# Altium schematic sheet cc_gen_and_heat_pwr.SchDoc: Hall / Main Board / current gen.
size A4; DocumentNumber: 3; SheetNumber: 3; SheetTotal: 7
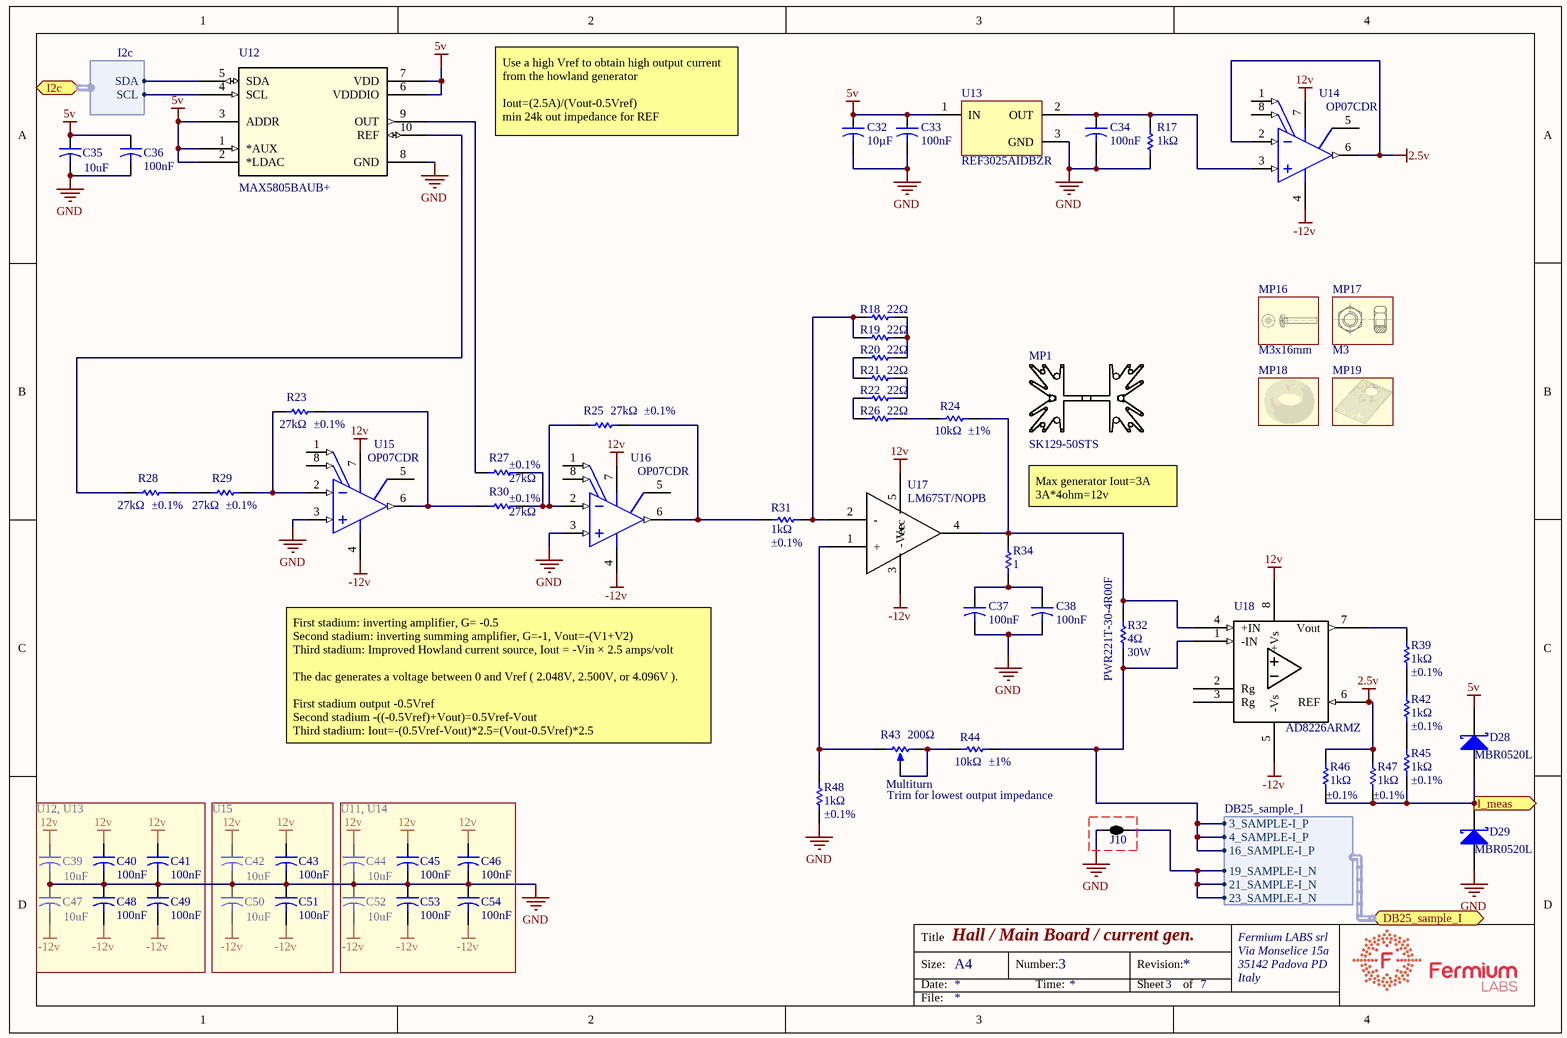
[diagram p0: cc_gen_and_heat_pwr.SchDoc]

## Parts
C32  Capacitance: 10µF  [CAP 1206/3216]
C33  Capacitance: 100nF  [CAP 0805/2012]
C34  Capacitance: 100nF  [CAP 0805/2012]
C35  value 10uF  [CAP 1206/3216]  (hidden comment: Cap2)
C36  Capacitance: 100nF  [CAP 0805/2012]
C37  Capacitance: 100nF  [CAP 0805/2012]
C38  Capacitance: 100nF  [CAP 0805/2012]
C39  value 10uF  [CAP 1206/3216]  (hidden comment: Cap2)
C40  Capacitance: 100nF  [CAP 0805/2012]
C41  Capacitance: 100nF  [CAP 0805/2012]
C42  value 10uF  [CAP 1206/3216]  (hidden comment: Cap2)
C43  Capacitance: 100nF  [CAP 0805/2012]
C44  value 10uF  [CAP 1206/3216]  (hidden comment: Cap2)
C45  Capacitance: 100nF  [CAP 0805/2012]
C46  Capacitance: 100nF  [CAP 0805/2012]
C47  value 10uF  [CAP 1206/3216]  (hidden comment: Cap2)
C48  Capacitance: 100nF  [CAP 0805/2012]
C49  Capacitance: 100nF  [CAP 0805/2012]
C50  value 10uF  [CAP 1206/3216]  (hidden comment: Cap2)
C51  Capacitance: 100nF  [CAP 0805/2012]
C52  value 10uF  [CAP 1206/3216]  (hidden comment: Cap2)
C53  Capacitance: 100nF  [CAP 0805/2012]
C54  Capacitance: 100nF  [CAP 0805/2012]
D28  Supplier Part Number 1: MBR0520L  [SOD123]
D29  Supplier Part Number 1: MBR0520L  [SOD123]
J10  2 way net tie junction  [2way_LP]  (value not drawn)  (net tie, no BOM)
MP1  (no value)  [SK129-50STS]
MP16  Size: M3x16mm  (hidden comment: screw-M3x25mm)  (mechanical)
MP17  Size: M3  (hidden comment: nut-M3)  (mechanical)
MP18  isolator-TO220  (value not drawn)  (mechanical)
MP19  thermpad-TO220  (value not drawn)  (mechanical)
R17  Resistance: 1kΩ  [RES 0805/2012]
R18  Resistance: 22Ω  [RES 0805/2012]
R19  Resistance: 22Ω  [RES 0805/2012]
R20  Resistance: 22Ω  [RES 0805/2012]
R21  Resistance: 22Ω  [RES 0805/2012]
R22  Resistance: 22Ω  [RES 0805/2012]
R23  Resistance: 27kΩ  Tolerance: ±0.1%  [RES 0805/2012]
R24  Resistance: 10kΩ  Tolerance: ±1%  [RES 0805/2012]
R25  Resistance: 27kΩ  Tolerance: ±0.1%  [RES 0805/2012]
R26  Resistance: 22Ω  [RES 0805/2012]
R27  Resistance: 27kΩ  Tolerance: ±0.1%  [RES 0805/2012]
R28  Resistance: 27kΩ  Tolerance: ±0.1%  [RES 0805/2012]
R29  Resistance: 27kΩ  Tolerance: ±0.1%  [RES 0805/2012]
R30  Resistance: 27kΩ  Tolerance: ±0.1%  [RES 0805/2012]
R31  Resistance: 1kΩ  Tolerance: ±0.1%  [RES 0805/2012]
R32  Resistance: 4Ω  Power: 30W  Manufacturer Part Number: PWR221T-30-4R00F  [to220-2pin]
R34  Resistance: 1  [STACKPOLE CSRN2512]
R39  Resistance: 1kΩ  Tolerance: ±0.1%  [RES 0805/2012]
R42  Resistance: 1kΩ  Tolerance: ±0.1%  [RES 0805/2012]
R43  Multiturn  Resistance: 200Ω  [trimmer-multiturn]
R44  Resistance: 10kΩ  Tolerance: ±1%  [RES 0805/2012]
R45  Resistance: 1kΩ  Tolerance: ±0.1%  [RES 0805/2012]
R46  Resistance: 1kΩ  Tolerance: ±0.1%  [RES 0805/2012]
R47  Resistance: 1kΩ  Tolerance: ±0.1%  [RES 0805/2012]
R48  Resistance: 1kΩ  Tolerance: ±0.1%  [RES 0805/2012]
U12  Manufacturer Part Number: MAX5805BAUB+  [21-0061L]
U13  (no value)  [TI-DBZ3_N]
U14  (no value)  [TI-D8_N]
U15  (no value)  [TI-D8_N]
U16  (no value)  [TI-D8_N]
U17  Supplier Part Number 1: LM675T/NOPB  [TO-220-5]
U18  Manufacturer Part Number: AD8226ARMZ  [MSOP_MO-187-AA AD8220]

## Blocks framed on the sheet
U12, U13: C39-C41 C47-C49
U15: C42 C43 C50 C51
U11, U14: C44-C46 C52-C54

## Ports
DB25_sample_I (harness DB25_sample_I), I2c (harness I2c), I_meas (out)

## Harnesses
I2c: SDA, SCL
DB25_sample_I: 16_SAMPLE-I_P, 19_SAMPLE-I_N, 21_SAMPLE-I_N, 23_SAMPLE-I_N, 3_SAMPLE-I_P, 4_SAMPLE-I_P

## Nets
2.5v: R46.2 R47.2 U14.2(IN-) U14.6(OUT) U18.6(REF)
5v: C32.1 C33.1 C35.1 C36.1 D28.K U12.1(*AUX) U12.2(*LDAC) U12.3(ADDR) U12.6(VDDDIO) U12.7(VDD) U13.1(IN)
12v: C39.1 C40.1 C41.1 C42.1 C43.1 C44.1 C45.1 C46.1 U14.7(VCC+) U15.7(VCC+) U16.7(VCC+) U17.5(Vcc) U18.8(+Vs)
-12v: C47.2 C48.2 C49.2 C50.2 C51.2 C52.2 C53.2 C54.2 U14.4(VCC-) U15.4(VCC-) U16.4(VCC-) U17.3(-Vee) U18.5(-Vs)
GND: C32.2 C33.2 C34.2 C35.2 C36.2 C37.2 C38.2 C39.2 C40.2 C41.2 C42.2 C43.2 C44.2 C45.2 C46.2 C47.1 C48.1 C49.1 C50.1 C51.1 C52.1 C53.1 C54.1 D29.A J10.1 R17.2 R48.2 U12.8(GND) U13.3(GND) U15.3(IN+) U16.3(IN+)
I_meas: D28.A D29.K R45.1 R46.1 R47.1 ; port I_meas
NetC34_1: C34.1 R17.1 U13.2(OUT) U14.3(IN+)
NetC37_1: C37.1 C38.1 R34.1
NetJ10_2: J10.2 ; port DB25_sample_I.19_SAMPLE-I_N, port DB25_sample_I.21_SAMPLE-I_N, port DB25_sample_I.23_SAMPLE-I_N
NetR18_1: R18.1 R19.1 R20.1
NetR18_2: R18.2 R19.2 R31.2 U17.2(-)
NetR20_2: R20.2 R21.2
NetR21_1: R21.1 R22.1
NetR22_2: R22.2 R26.2
NetR23_1: R23.1 R30.2 U15.6(OUT)
NetR23_2: R23.2 R29.1 U15.2(IN-)
NetR24_1: R24.1 R32.1 R34.2 U17.4(OUT) U18.4(+IN)
NetR24_2: R24.2 R26.1
NetR25_1: R25.1 R31.1 U16.6(OUT)
NetR25_2: R25.2 R27.1 R30.1 U16.2(IN-)
NetR27_2: R27.2 U12.9(OUT)
NetR28_1: R28.1 R29.2
NetR28_2: R28.2 U12.10(REF)
NetR32_2: R32.2 R44.1 U18.1(-IN) ; port DB25_sample_I.16_SAMPLE-I_P, port DB25_sample_I.3_SAMPLE-I_P, port DB25_sample_I.4_SAMPLE-I_P
NetR39_1: R39.1 R42.2
NetR39_2: R39.2 U18.7(Vout)
NetR42_1: R42.1 R45.2
NetR43_1: R43.1 R48.1 U17.1(+)
NetR43_2: R43.2 R43.3 R44.2
NetU12_4: U12.4(SCL) ; port I2c.SCL
NetU12_5: U12.5(SDA) ; port I2c.SDA

Not connected (* = marked no-connect by the designer): U14 1(OFFSET_N1) 5(NC) 8(OFFSET_N2); U15 1(OFFSET_N1) 5(NC) 8(OFFSET_N2); U16 1(OFFSET_N1) 5(NC) 8(OFFSET_N2); U18 2(Rg) 3(Rg)

## Notes on the sheet
- Use a high Vref to obtain high output current from the howland generator
  Iout=(2.5A)/(Vout-0.5Vref)
  min 24k out impedance for REF
- Max generator Iout=3A
  3A*4ohm=12v
- First stadium: inverting amplifier, G= -0.5
  Second stadium: inverting summing amplifier, G=-1, Vout=-(V1+V2)
  Third stadium: Improved Howland current source, Iout = -Vin × 2.5 amps/volt
  The dac generates a voltage between 0 and Vref ( 2.048V, 2.500V, or 4.096V ).
  First stadium output -0.5Vref
  Second stadium -((-0.5Vref)+Vout)=0.5Vref-Vout
  Third stadium: Iout=-(0.5Vref-Vout)*2.5=(Vout-0.5Vref)*2.5
- Trim for lowest output impedance
- Title
- Size:
- Date:
- A4
- Number:
- Time:
- Revision:
- Sheet
- of
- Fermium LABS srl
- Via Monselice 15a
- 35142 Padova PD
- Italy
- File:

## Library data of the parts
C32 = Cap2: Capacitor; Manufacturer: SAMSUNG; Manufacturer Part Number: CL31A106KAHNNNE; Unit: pcs; SuppliedAmount: 0; MinAmount: 100; Capacitor type: ceramic; Capacitor kind: MLCC; Operating voltage: 25V; Dielectric: X5R; Tolerance: ±10%; Case - inch: 1206; Case - mm: 3216; Pads: 2 SMD; Published: 23-Sep-2002; PackageReference: CAPR5-4X5; Publisher: Altium Limited; PackageDescription: 1206; Supplier 1: TME; Supplier Part Number 1: CL31A106KAHNNNE; Category: 1206 MLCC SMD Capacitors; Stock 1: 279700; Pricing 1: 100=0.0248, 300=0.0203, 1000=0.0167, 2000=0.0131, 10000=0.0127 (EUR); Weight: 0.061; Multiples: 100; Mounting: SMD; Operating temperature: -55...85°C; Price Type: NET; ComponentLink1URL: http://static.tme.eu/products_pics/b/e/9/be9e0dd298dcf4979ea1dd3d226e0bfa/58780.jpg; ComponentLink1Description: http://static.tme.eu/products_pics/b/e/9/be9e0dd298dcf4979ea1dd3d226e0bfa/58780.jpg
C33 C34 C37 C38 = Cap2: Capacitor; Manufacturer: YAGEO; Manufacturer Part Number: CC0805JRX7R9BB104; Unit: pcs; SuppliedAmount: 0; MinAmount: 100; Capacitor type: ceramic; Capacitor kind: MLCC; Operating voltage: 50V; Dielectric: X7R; Tolerance: ±5%; Case - inch: 0805; Case - mm: 2012; Pads: 2 SMD; Supplier 1: TME; Supplier Part Number 1: CC0805JRX7R9104; Category: 0805 MLCC SMD Capacitors; Stock 1: 89911; Pricing 1: 100=0.00613, 300=0.00464, 1000=0.00342, 4000=0.00284, 20000=0.00273 (EUR); Weight: 0.042; Multiples: 100; Mounting: SMD; Price Type: NET; ComponentLink1URL: http://static.tme.eu/products_pics/d/b/b/dbbd93eaf25225110ca26eb66da77328/58538.jpg; ComponentLink1Description: http://static.tme.eu/products_pics/d/b/b/dbbd93eaf25225110ca26eb66da77328/58538.jpg
C35 C39 C42 C47 C50 C52 = Cap2: Capacitor; Manufacturer: SAMSUNG; Manufacturer Part Number: CL31A106KAHNNNE; Unit: pcs; SuppliedAmount: 0; MinAmount: 100; Capacitor type: ceramic; Capacitor kind: MLCC; Capacitance: 10µF; Operating voltage: 25V; Dielectric: X5R; Tolerance: ±10%; Case - inch: 1206; Case - mm: 3216; Pads: 2 SMD; Published: 23-Sep-2002; PackageReference: CAPR5-4X5; Publisher: Altium Limited; PackageDescription: 1206; Supplier 1: TME; Supplier Part Number 1: CL31A106KAHNNNE; Category: 1206 MLCC SMD Capacitors; Stock 1: 279700; Pricing 1: 100=0.0248, 300=0.0203, 1000=0.0167, 2000=0.0131, 10000=0.0127 (EUR); Weight: 0.061; Multiples: 100; Mounting: SMD; Operating temperature: -55...85°C; Price Type: NET; ComponentLink1URL: http://static.tme.eu/products_pics/b/e/9/be9e0dd298dcf4979ea1dd3d226e0bfa/58780.jpg; ComponentLink1Description: http://static.tme.eu/products_pics/b/e/9/be9e0dd298dcf4979ea1dd3d226e0bfa/58780.jpg
C36 C40 C41 C43 C45 C46 C48 C49 C51 C53 C54 = Cap2: Capacitor; Manufacturer: YAGEO; Manufacturer Part Number: CC0805JRX7R9BB104; Pads: 2 SMD; Supplier 1: TME; Supplier Part Number 1: CC0805JRX7R9104
C44 = Cap2: Capacitor; Manufacturer: SAMSUNG; Manufacturer Part Number: CL31A106KAHNNNE; Unit: pcs; SuppliedAmount: 0; MinAmount: 100; Capacitor type: ceramic; Capacitor kind: MLCC; Capacitance: 10µF; Operating voltage: 25V; Dielectric: X5R; Tolerance: ±10%; Case - inch: 1206; Case - mm: 3216; 2 SMD: Pads; Pads: 2 SMD; Published: 23-Sep-2002; PackageReference: CAPR5-4X5; Publisher: Altium Limited; PackageDescription: 1206; Supplier 1: TME; Supplier Part Number 1: CL31A106KAHNNNE; Category: 1206 MLCC SMD Capacitors; Stock 1: 279700; Pricing 1: 100=0.0248, 300=0.0203, 1000=0.0167, 2000=0.0131, 10000=0.0127 (EUR); Weight: 0.061; Multiples: 100; Mounting: SMD; Operating temperature: -55...85°C; Price Type: NET; ComponentLink1URL: http://static.tme.eu/products_pics/b/e/9/be9e0dd298dcf4979ea1dd3d226e0bfa/58780.jpg; ComponentLink1Description: http://static.tme.eu/products_pics/b/e/9/be9e0dd298dcf4979ea1dd3d226e0bfa/58780.jpg
D28 D29 = D Schottky: Schottky Diode; Manufacturer: FAIRCHILD SEMICONDUCTOR; Unit: pcs; SuppliedAmount: 0; MinAmount: 10; Multiples: 1; Diode type: Schottky rectifying; Off state voltage max.: 20V; Forward voltage at If: 390mV; Load current: 500mA; Pads: 2 SMD; Published: 8-Jun-2000; LatestRevisionDate: 17-Jul-2002; LatestRevisionNote: Re-released for DXP Platform.; PackageReference: SMB; Publisher: Altium Limited; PackageDescription: DO-214-AA/SMB; 2 C-Bend Leads; Body 5.3 x 3.6 mm, inc. leads (LxW); Code_JEDEC: DO-214-AA; Supplier 1: TME; Manufacturer Part Number: MBR0520L; Category: SMD Schottky Diodes; Stock 1: 24595; Pricing 1: 10=0.0403, 50=0.0376, 250=0.0333, 1000=0.03, 3000=0.0281 (EUR); Weight: 0.032; Case: SOD123; Mounting: SMD; Price Type: NET; ComponentLink1URL: http://static.tme.eu/products_pics/e/d/b/edbd030cb344fc64745afa0f91101952/285567.jpg; ComponentLink1Description: http://static.tme.eu/products_pics/e/d/b/edbd030cb344fc64745afa0f91101952/285567.jpg
J10 = 2way: ComponentLink1URL: http://www.edatools.cz/addons; ComponentLink1Description: Source; FootprintNote: LP=12mil, MP=40mil, HP=120mil
MP1 = SK129-63STS: Pads: 2 THT; Supplier 1: TME; Supplier Part Number 1: SK129-50STS; Manufacturer Part Number: SK129-50STS
MP16 = screw-M3x25mm: Manufacturer Part Number: M3X16/D7985; Manufacturer: KRAFTBERG; Supplier 1: TME; Supplier Part Number 1: M3X16/D7985
MP17 = nut-M3: Manufacturer Part Number: 1874659; Manufacturer: BOSSARD; Supplier 1: TME; Supplier Part Number 1: B3/BN117
MP18 = isolator-TO220: Manufacturer Part Number: NIPPEL-TO220/1; Manufacturer: NINIGI; Supplier 1: TME; Supplier Part Number 1: NIPPEL-TO220/1
MP19 = thermpad-TO220: Manufacturer Part Number: GS 220 4; Manufacturer: FISCHER ELEKTRONIK; Supplier 1: TME; Supplier Part Number 1: GS/220/4
R17 = Res1: Resistor; Manufacturer: VIKING; Manufacturer Part Number: AR05BTCW1001; Manufacturer series: AR; Unit: pcs; SuppliedAmount: 0; MinAmount: 10; Kind of resistor: precise; Case - inch: 0805; Case - mm: 2012; Power: 0.125W; Tolerance: ±0.1%; Max. operating voltage: 150V; Max. overload voltage: 300V; Temperature coefficient: 25ppm/°C; Pads: 2 SMD; Published: 8-Jun-2000; LatestRevisionDate: 17-Jul-2002; LatestRevisionNote: Re-released for DXP Platform.; PackageReference: AXIAL-0.3; Publisher: Altium Limited; PackageDescription: Axial Device, Thru-Hole; 2 Leads; 0.3 in Pin Spacing; Supplier 1: TME; Supplier Part Number 1: AR0805-1K-0.1%; Category: 0805 SMD Precision Resistors; Stock 1: 0; Pricing 1: 10=0.11211, 100=0.05707, 1000=0.03771, 5000=0.03176 (EUR); Weight: 0.034; Multiples: 10; Resistor type: thin film; Mounting: SMD; Operating temperature: -55...155°C; Price Type: NET; ComponentLink1URL: http://static.tme.eu/products_pics/6/6/c/66cc5cd64257edd80ca8e9fd2040972d/56038.jpg; ComponentLink1Description: http://static.tme.eu/products_pics/6/6/c/66cc5cd64257edd80ca8e9fd2040972d/56038.jpg; Supplier 2: TME; Supplier Part Number 2: AR0805-1K13-0.1%; Stock 2: 750; Pricing 2: 10=0.11119, 100=0.05661, 1000=0.0374, 5000=0.0315 (EUR)
R18-R22 R26 = Res1: Resistor; Manufacturer: ROYAL OHM; Manufacturer Part Number: 0805S8F220JT5E; Unit: pcs; SuppliedAmount: 0; MinAmount: 100; Case - inch: 0805; Case - mm: 2012; Power: 0.125W; Tolerance: ±1%; Max. operating voltage: 150V; Max. overload voltage: 300V; Temperature coefficient: 200ppm/°C; Pads: 2 SMD; Supplier 1: TME; Supplier Part Number 1: SMD0805-22R-1%; Category: 0805 SMD Resistors; Stock 1: 22000; Pricing 1: 100=0.00846, 1000=0.00329, 5000=0.00113, 15000=0.00108, 50000=0.00103 (EUR); Weight: 0.031; Multiples: 100; Resistor type: thick film; Mounting: SMD; Operating temperature: -55...125°C; Price Type: NET; ComponentLink1URL: http://static.tme.eu/products_pics/a/3/4/a34f7a182e69d69fdfdb65c44b99ca64/60560.jpg; ComponentLink1Description: http://static.tme.eu/products_pics/a/3/4/a34f7a182e69d69fdfdb65c44b99ca64/60560.jpg
R23 R25 R27-R30 = Res1: Resistor; Manufacturer: VIKING; Manufacturer Part Number: AR05BTCW2702; Manufacturer series: AR; Unit: pcs; SuppliedAmount: 0; MinAmount: 10; Kind of resistor: precise; Case - inch: 0805; Case - mm: 2012; Power: 0.125W; Max. operating voltage: 150V; Max. overload voltage: 300V; Temperature coefficient: 25ppm/°C; Pads: 2 SMD; Supplier 1: TME; Supplier Part Number 1: AR0805-27K-0.1%; Category: 0805 SMD Precision Resistors; Stock 1: 270; Pricing 1: 10=0.11146, 100=0.05674, 1000=0.0375, 5000=0.03158 (EUR); Weight: 0.084; Multiples: 10; Resistor type: thin film; Mounting: SMD; Operating temperature: -55...155°C; Price Type: NET; ComponentLink1URL: http://static.tme.eu/products_pics/6/6/c/66cc5cd64257edd80ca8e9fd2040972d/56038.jpg; ComponentLink1Description: http://static.tme.eu/products_pics/6/6/c/66cc5cd64257edd80ca8e9fd2040972d/56038.jpg
R24 R44 = Res1: Resistor; Manufacturer: ROYAL OHM; Manufacturer Part Number: 0805S8F1002T5E; Unit: pcs; SuppliedAmount: 0; MinAmount: 100; Case - inch: 0805; Case - mm: 2012; Power: 0.125W; Max. operating voltage: 150V; Max. overload voltage: 300V; Temperature coefficient: 100ppm/°C; Pads: 2 SMD; Supplier 1: TME; Supplier Part Number 1: SMD0805-10K-1%; Category: 0805 SMD Resistors; Stock 1: 967000; Pricing 1: 100=0.00735, 1000=0.00287, 5000=0.00105, 15000=0.00095, 50000=0.00093 (EUR); Weight: 0.031; Multiples: 100; Resistor type: thick film; Mounting: SMD; Operating temperature: -55...125°C; Price Type: NET; ComponentLink1URL: http://static.tme.eu/products_pics/a/3/4/a34f7a182e69d69fdfdb65c44b99ca64/60560.jpg; ComponentLink1Description: http://static.tme.eu/products_pics/a/3/4/a34f7a182e69d69fdfdb65c44b99ca64/60560.jpg
R31 R39 R42 R45-R48 = Res1: Resistor; Manufacturer: VIKING; Manufacturer Part Number: AR05BTCW1001; Manufacturer series: AR; Unit: pcs; SuppliedAmount: 0; MinAmount: 10; Kind of resistor: precise; Case - inch: 0805; Case - mm: 2012; Power: 0.125W; Max. operating voltage: 150V; Max. overload voltage: 300V; Temperature coefficient: 25ppm/°C; Pads: 2 SMD; Published: 8-Jun-2000; LatestRevisionDate: 17-Jul-2002; LatestRevisionNote: Re-released for DXP Platform.; PackageReference: AXIAL-0.3; Publisher: Altium Limited; PackageDescription: Axial Device, Thru-Hole; 2 Leads; 0.3 in Pin Spacing; Supplier 1: TME; Supplier Part Number 1: AR0805-1K-0.1%; Category: 0805 SMD Precision Resistors; Stock 1: 0; Pricing 1: 10=0.11211, 100=0.05707, 1000=0.03771, 5000=0.03176 (EUR); Weight: 0.034; Multiples: 10; Resistor type: thin film; Mounting: SMD; Operating temperature: -55...155°C; Price Type: NET; ComponentLink1URL: http://static.tme.eu/products_pics/6/6/c/66cc5cd64257edd80ca8e9fd2040972d/56038.jpg; ComponentLink1Description: http://static.tme.eu/products_pics/6/6/c/66cc5cd64257edd80ca8e9fd2040972d/56038.jpg; Supplier 2: TME; Supplier Part Number 2: AR0805-1K13-0.1%; Stock 2: 750; Pricing 2: 10=0.11119, 100=0.05661, 1000=0.0374, 5000=0.0315 (EUR)
R32 = Res1: Resistor; Supplier 1: Mouser; Supplier Part Number 1: 652-PWR221T-30-4R00F
R34 = Res1: Resistor; Manufacturer Part Number 1: 25121WJ010JT5E; Manufacturer: ROYAL OHM; Pads: 2 SMD; Supplier 1: TME; Supplier Part Number 1: SMD2512-1R
R43 = RPot: Potentiometer; Manufacturer: SR PASSIVES; Manufacturer Part Number: T910W-200R; Supplier 1: TME; Supplier Part Number 1: T910W-200R
U12 = MAX5805AAUB+: Imported; Manufacturer: Maxim Integrated; Vendor: Maxim Integrated Products; C: Copyright (C) 2015 Accelerated Designs. All rights reserved; Number of Converters: 1 Converter; Output Type: Voltage Buffered; Resolution: 12 bit; Interface Type: Serial, I2C; Number of Channels: 1 Channel; DNL - Differential Nonlinearity: +/- 0.2 LSB; Gain Error: 0.5 %FS; INL - Integral Nonlinearity: +/- 0.5 LSB; Pd - Power Dissipation: 707.3 mW; Reference Voltage: 4.096 V; Settling Time: 6.3 us; Supply Voltage - Max: 5.5 V; Supply Voltage - Min: 2.7 V; Pads: 10 SMD; Copyright: Copyright (C) 2015 Accelerated Designs. All rights reserved; RefDes: RefDes; Type: DEV; Value: Value; Supplier 1: Mouser; Supplier Part Number 1: 700-MAX5805BAUB+; RoHS: RoHS Compliant; Category: Digital to Analog Converters - DAC; Stock 1: 323; Pricing 1: 1=1.26, 10=1.21 (EUR); Package / Case: UMAX-10; Packaging: Tube; Product: Digital to Analog Converters; Series: MAX5805; Brand: Maxim Integrated; Mounting Style: SMD/SMT; Maximum Operating Temperature: + 125 C; Minimum Operating Temperature: - 40 C; Standard Pack Qty: 50; RoHS - Mouser: Y; Minimum Order Quantity: 1; Reeling: False; ComponentLink1URL: http://www.mouser.com/ds/2/256/MAX5803-MAX5805-472540.pdf; ComponentLink1Description: http://www.mouser.com/ds/2/256/MAX5803-MAX5805-472540.pdf
U13 = REF3025AIDBZR: Voltage reference, 2.5V; Manufacturer: Texas Instruments; Accuracy: 100 uV/mA; Temperature Coefficient: 50 PPM / C; Reference Type: Series References; Series VREF - Input Voltage - Max: 5.5 V; Shunt Current - Max: 25 mA; Supply Current - Max: 50 uA; Initial Accuracy: 0.2 %; Operating Supply Current: 42 uA; Pads: 3 SMD; Supplier 1: Mouser; Supplier Part Number 1: 595-REF3025AIDBZR; Manufacturer Part Number: REF3025AIDBZR; RoHS: RoHS Compliant; Category: Voltage References; Stock 1: 2808; Pricing 1: 1=1.29, 10=1.15, 25=1.06, 50=0.950, 100=0.900, 250=0.841, 500=0.743, 1000=0.508, 3000=0.508 (EUR); Height: 1 mm; Length: 2.92 mm; Operating Temperature Range: - 40 C to + 125 C; Output Voltage: 2.5 V; Package / Case: SOT-23-3; Packaging: Reel; Product: Voltage References; Series: REF3025; Width: 1.3 mm; Brand: Texas Instruments; Mounting Style: SMD/SMT; Topology: Series References; Maximum Operating Temperature: + 125 C; Minimum Operating Temperature: - 40 C; Standard Pack Qty: 3000; RoHS - Mouser: Y; Minimum Order Quantity: 1; Reeling: True
U14-U16 = OP07CDR: Low-Offset Voltage Operational Amplifier, 6 to 36 V, 0 to 70 degC, 8-pin SOIC (D8), Green (RoHS & no Sb/Br); Manufacturer: TEXAS INSTRUMENTS; Unit: pcs; SuppliedAmount: 0; MinAmount: 3; Multiples: 1; Transmission band frequency: 600kHz; Supply voltage: 3...18V DC; Slew rate: 0.3V/μs; Pads: 8 SMD; Supplier 1: TME; Supplier Part Number 1: OP07CDR; Manufacturer Part Number: OP07CDR; Category: SMD Operational Amplifiers; Stock 1: 2258; Pricing 1: 3=0.2668, 10=0.2451, 50=0.2177, 250=0.1848, 1000=0.165 (EUR); Weight: 0.23; Integrated circuit type: operational amplifier; Mounting: SMD; Number of channels: 1; Case: SO8; Price Type: NET; ComponentLink1URL: http://static.tme.eu/products_pics/4/8/a/48a33ccfb5a851d5982dcdda0776f7ac/285338.jpg; ComponentLink1Description: http://static.tme.eu/products_pics/4/8/a/48a33ccfb5a851d5982dcdda0776f7ac/285338.jpg
U17 = lm675: Manufacturer: TEXAS INSTRUMENTS; Unit: pcs; SuppliedAmount: 0; MinAmount: 1; Integrated circuit type: operational amplifier; Transmission band frequency: 5.5MHz; Supply voltage: 16...60V DC; Slew rate: 8V/μs; Pads: 5 THT; Supplier 1: TME; Manufacturer Part Number: LM675T/NOPB; Category: THT Operational Amplifiers; Stock 1: 27; Pricing 1: 1=4.39, 3=4.18, 10=3.64, 25=3.17 (EUR); Weight: 2.033; Multiples: 1; Mounting: THT; Number of channels: 1; Case: TO220-5; Operating temperature: 0...70°C; Price Type: NET; ComponentLink1URL: http://static.tme.eu/products_pics/8/4/8/84875f56cd122364db0c84d2b63a2f07/59360.jpg; ComponentLink1Description: http://static.tme.eu/products_pics/8/4/8/84875f56cd122364db0c84d2b63a2f07/59360.jpg
U18 = AD8226: Instrumentation amplifier; Manufacturer: Analog Devices; Supply Type: Single, Dual; Number of Channels: 1 Channel; 3 dB Bandwidth: 1.5 MHz; CMRR - Common Mode Rejection Ratio: 120 dB; Dual Supply Voltage: 1.35 V to 18 V; Gain V/V: 1 V/V to 1000 V/V; Ib - Input Bias Current: 35 nA; Maximum Input Resistance: 800 MOhms at +/- 15 V; Operating Supply Current: 325 uA; Operating Supply Voltage: 2.2 V to 36 V; SR - Slew Rate: 0.4 V/us; Supply Voltage - Max: 36 V; Supply Voltage - Min: 2.2 V; Voltage Gain dB: 60 dB; Vos - Input Offset Voltage: 100 uV; Pads: 8 SMD; Supplier 1: Mouser; Supplier Part Number 1: 584-AD8226ARMZ; RoHS: RoHS Compliant; Category: Instrumentation Amplifiers; Stock 1: 679; Pricing 1: 1=2.48, 10=2.22, 25=1.99, 50=1.87, 100=1.82, 250=1.64, 500=1.47, 1000=1.28 (EUR); Amplifier Type: Instrumentation Amplifier; Height: 0.85 mm; Length: 3 mm; Package / Case: MSOP-8; Packaging: Tube; Product: Instrumentation Amplifiers; Series: AD8226; Width: 3 mm; Brand: Analog Devices; Mounting Style: SMD/SMT; GBP - Gain Bandwidth Product: -; Maximum Operating Temperature: + 125 C; Minimum Operating Temperature: - 40 C; Standard Pack Qty: 50; Vcm - Common Mode Voltage: 2.2 V to 36 V; RoHS - Mouser: Y; Minimum Order Quantity: 1; Reeling: False; ComponentLink1URL: http://www.mouser.com/ds/2/609/AD8226-877720.pdf; ComponentLink1Description: http://www.mouser.com/ds/2/609/AD8226-877720.pdf